# EAGLE schematic GaN_Fet_ESC_V0.2 (EAGLE 9.6.2)

## Sheet 1 of 2: Power Stage
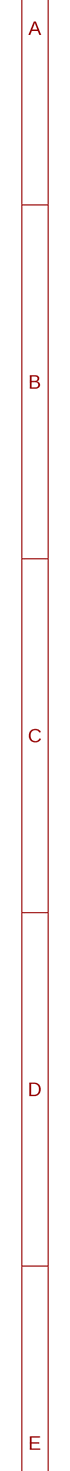
[diagram p0: schematic, sheet 1, part 1 of 2]
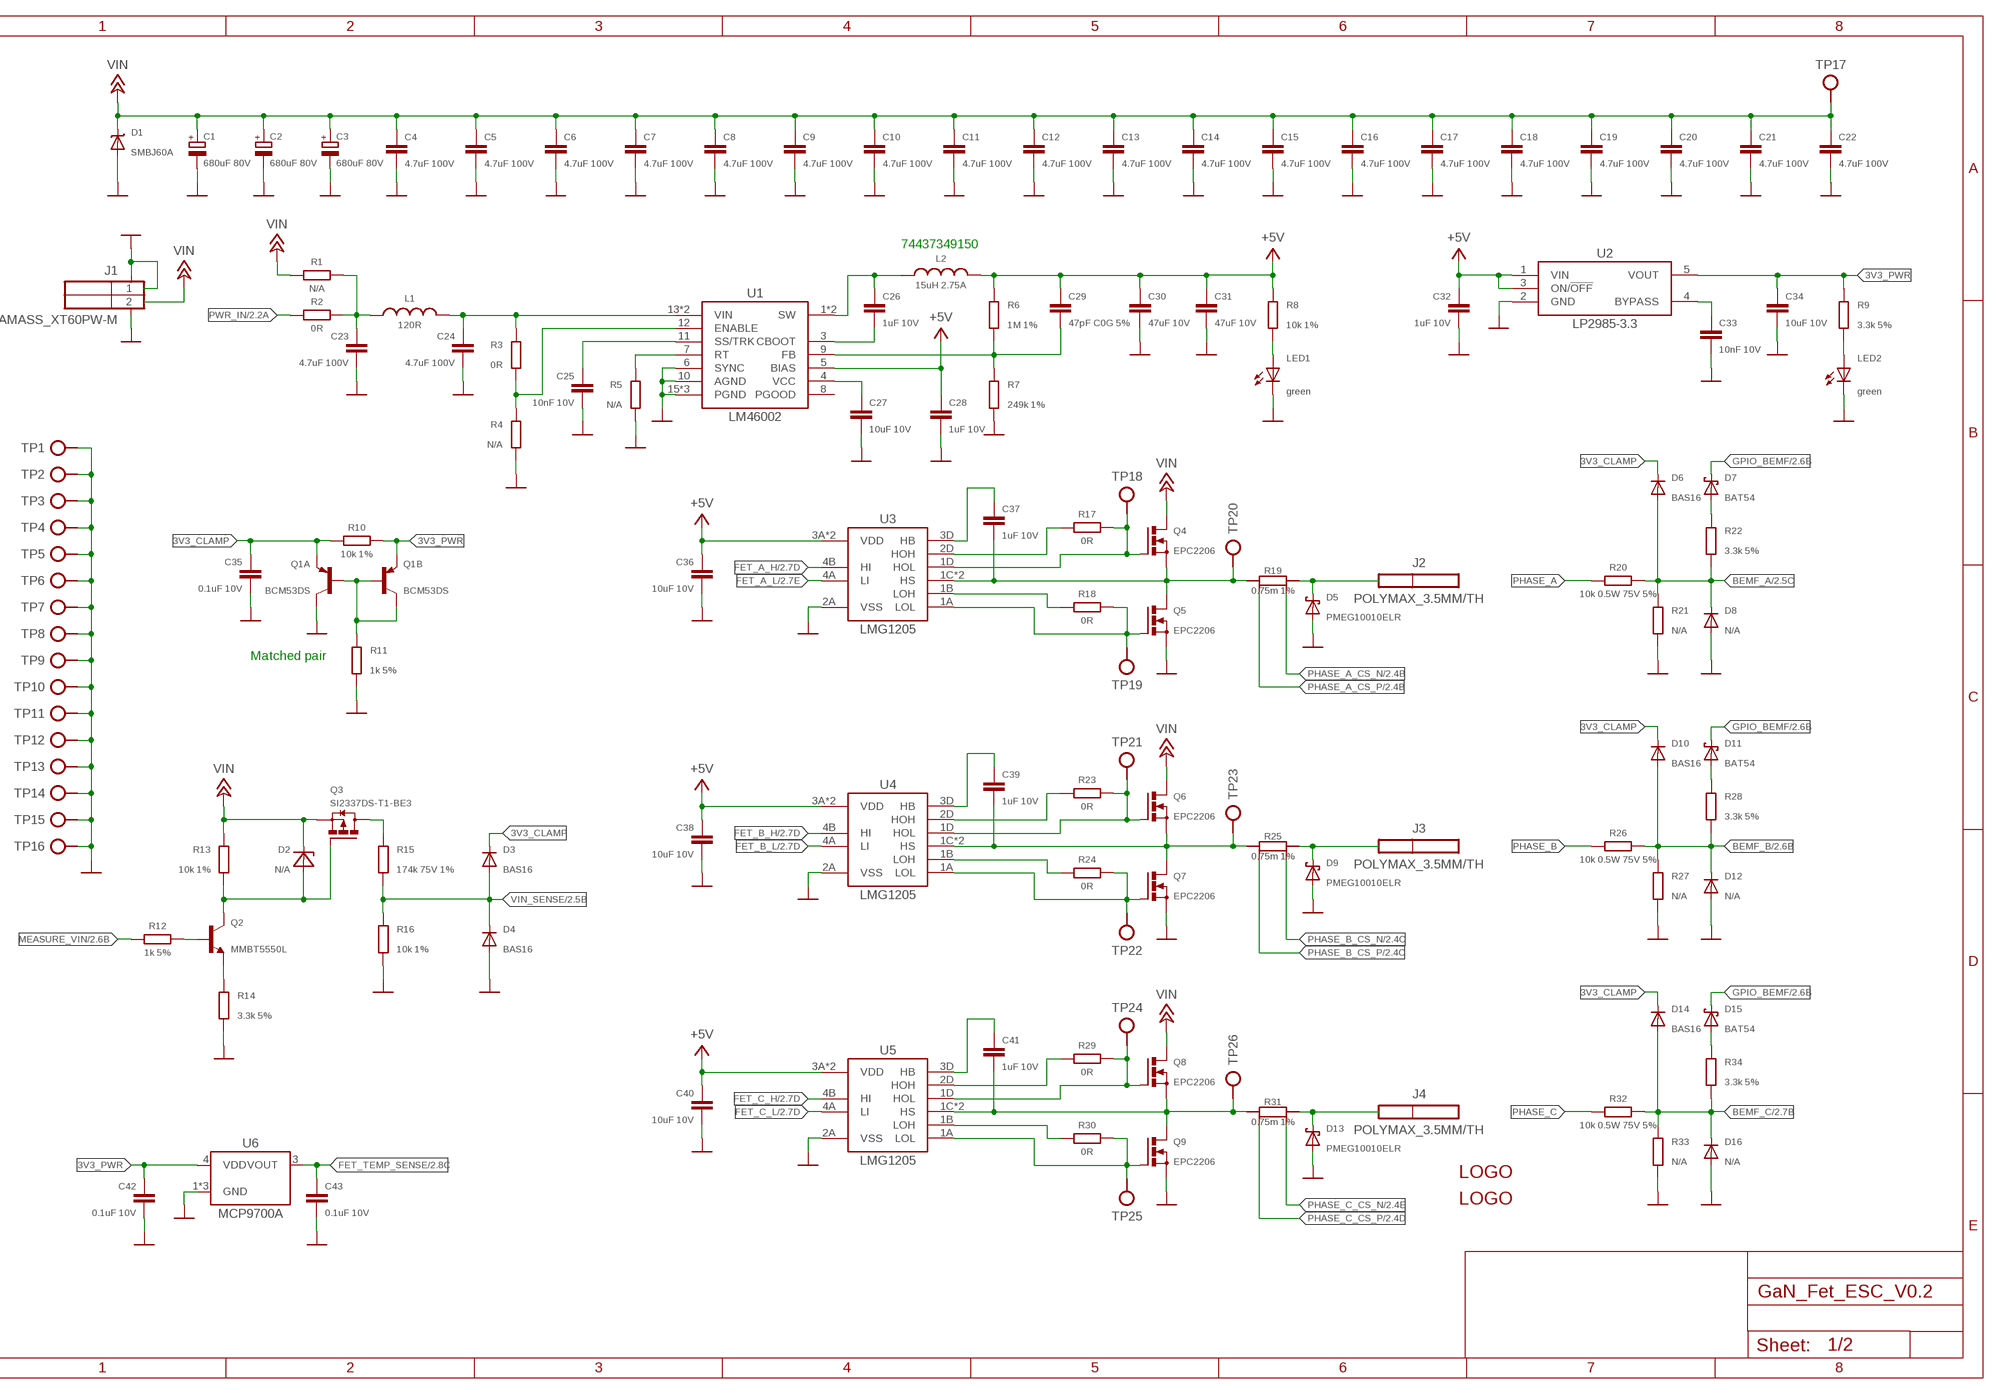
[diagram p1: schematic, sheet 1, part 2 of 2]

### Parts
C1  680uF 80V  CAPACITOR_ELECTROLYTIC4  [C_7.50_16_26.5_4]
C2  680uF 80V  CAPACITOR_ELECTROLYTIC6  [C_7.50_16_26.5_6]
C3  680uF 80V  CAPACITOR_ELECTROLYTIC5  [C_7.50_16_26.5_5]
C4  4.7uF 100V  CAPACITOR_CERAMIC/1210  [C1210]
C5  4.7uF 100V  CAPACITOR_CERAMIC/1210  [C1210]
C6  4.7uF 100V  CAPACITOR_CERAMIC/1210  [C1210]
C7  4.7uF 100V  CAPACITOR_CERAMIC/1210  [C1210]
C8  4.7uF 100V  CAPACITOR_CERAMIC/1210  [C1210]
C9  4.7uF 100V  CAPACITOR_CERAMIC/1210  [C1210]
C10  4.7uF 100V  CAPACITOR_CERAMIC/1210  [C1210]
C11  4.7uF 100V  CAPACITOR_CERAMIC/1210  [C1210]
C12  4.7uF 100V  CAPACITOR_CERAMIC/1210  [C1210]
C13  4.7uF 100V  CAPACITOR_CERAMIC/1210  [C1210]
C14  4.7uF 100V  CAPACITOR_CERAMIC/1210  [C1210]
C15  4.7uF 100V  CAPACITOR_CERAMIC/1210  [C1210]
C16  4.7uF 100V  CAPACITOR_CERAMIC/1210  [C1210]
C17  4.7uF 100V  CAPACITOR_CERAMIC/1210  [C1210]
C18  4.7uF 100V  CAPACITOR_CERAMIC/1210  [C1210]
C19  4.7uF 100V  CAPACITOR_CERAMIC/1210  [C1210]
C20  4.7uF 100V  CAPACITOR_CERAMIC/1210  [C1210]
C21  4.7uF 100V  CAPACITOR_CERAMIC/1210  [C1210]
C22  4.7uF 100V  CAPACITOR_CERAMIC/1210  [C1210]
C23  4.7uF 100V  CAPACITOR_CERAMIC/1210  [C1210]
C24  4.7uF 100V  CAPACITOR_CERAMIC/1210  [C1210]
C25  10nF 10V  CAPACITOR_CERAMIC/0402  [C0402]
C26  1uF 10V  CAPACITOR_CERAMIC/0402  [C0402]
C27  10uF 10V  CAPACITOR_CERAMIC/0603  [C0603]
C28  1uF 10V  CAPACITOR_CERAMIC/0402  [C0402]
C29  47pF C0G 5%  CAPACITOR_CERAMIC/0402  [C0402]
C30  47uF 10V  CAPACITOR_CERAMIC/1206  [C1206]
C31  47uF 10V  CAPACITOR_CERAMIC/1206  [C1206]
C32  1uF 10V  CAPACITOR_CERAMIC/0402  [C0402]
C33  10nF 10V  CAPACITOR_CERAMIC/0402  [C0402]
C34  10uF 10V  CAPACITOR_CERAMIC/0603  [C0603]
C35  0.1uF 10V  CAPACITOR_CERAMIC/0402  [C0402]
C36  10uF 10V  CAPACITOR_CERAMIC/0603  [C0603]
C37  1uF 10V  CAPACITOR_CERAMIC/0402  [C0402]
C38  10uF 10V  CAPACITOR_CERAMIC/0603  [C0603]
C39  1uF 10V  CAPACITOR_CERAMIC/0402  [C0402]
C40  10uF 10V  CAPACITOR_CERAMIC/0603  [C0603]
C41  1uF 10V  CAPACITOR_CERAMIC/0402  [C0402]
C42  0.1uF 10V  CAPACITOR_CERAMIC/0402  [C0402]
C43  0.1uF 10V  CAPACITOR_CERAMIC/0402  [C0402]
D1  SMBJ60A  DIODE_TVS_UNIDIR/SMB  [DO214AA(SMB)]
D2  N/A  DIODE_ZENER  [SOD323F]
D3  BAS16  DIODE/SOD523  [SOD523]
D4  BAS16  DIODE/SOD523  [SOD523]
D5  PMEG10010ELR  DIODE_SCHOTTKY/SOD123  [SOD123F]
D6  BAS16  DIODE/SOD523  [SOD523]
D7  BAT54  DIODE_SCHOTTKY/SOD523  [SOD523]
D8  N/A  DIODE/SOD523  [SOD523]
D9  PMEG10010ELR  DIODE_SCHOTTKY/SOD123  [SOD123F]
D10  BAS16  DIODE/SOD523  [SOD523]
D11  BAT54  DIODE_SCHOTTKY/SOD523  [SOD523]
D12  N/A  DIODE/SOD523  [SOD523]
D13  PMEG10010ELR  DIODE_SCHOTTKY/SOD123  [SOD123F]
D14  BAS16  DIODE/SOD523  [SOD523]
D15  BAT54  DIODE_SCHOTTKY/SOD523  [SOD523]
D16  N/A  DIODE/SOD523  [SOD523]
J1  AMASS_XT60PW-M  [AMASS_XT60PW-M]
J2  POLYMAX_3.5MM/TH  [POLYMAX_3.5MM_TH]
J3  POLYMAX_3.5MM/TH  [POLYMAX_3.5MM_TH]
J4  POLYMAX_3.5MM/TH  [POLYMAX_3.5MM_TH]
L1  120R  INDUCTOR/1206  [L1206]
L2  15uH 2.75A  INDUCTOR/WE-LHMI  [WURTH_6.6X6.6]
LED1  green  LED/0603  [CHIP-LED0603]
LED2  green  LED/0603  [CHIP-LED0603]
LOGO1  LOGO  [LOGO]
LOGO2  LOGO  [LOGO]
Q1  BCM53DS  BJT_PNP_DUAL/BCM53DS  [SC-74]
Q2  MMBT5550L  BJT_NPN/SOT23  [SOT23]
Q3  SI2337DS-T1-BE3  P-FET/SOT23  [SOT23]
Q4  EPC2206  GAN-N-FET  [EPC2206]
Q5  EPC2206  GAN-N-FET  [EPC2206]
Q6  EPC2206  GAN-N-FET  [EPC2206]
Q7  EPC2206  GAN-N-FET  [EPC2206]
Q8  EPC2206  GAN-N-FET  [EPC2206]
Q9  EPC2206  GAN-N-FET  [EPC2206]
R1  N/A  RESISTOR_SMD/0603  [R0603]
R2  0R  RESISTOR_SMD/0603  [R0603]
R3  0R  RESISTOR_SMD/0603  [R0603]
R4  N/A  RESISTOR_SMD/0402  [R0402]
R5  N/A  RESISTOR_SMD/0402  [R0402]
R6  1M 1%  RESISTOR_SMD/0402  [R0402]
R7  249k 1%  RESISTOR_SMD/0402  [R0402]
R8  10k 1%  RESISTOR_SMD/0402  [R0402]
R9  3.3k 5%  RESISTOR_SMD/0402  [R0402]
R10  10k 1%  RESISTOR_SMD/0402  [R0402]
R11  1k 5%  RESISTOR_SMD/0402  [R0402]
R12  1k 5%  RESISTOR_SMD/0402  [R0402]
R13  10k 1%  RESISTOR_SMD/0402  [R0402]
R14  3.3k 5%  RESISTOR_SMD/0402  [R0402]
R15  174k 75V 1%  RESISTOR_SMD/0603  [R0603]
R16  10k 1%  RESISTOR_SMD/0402  [R0402]
R17  0R  RESISTOR_SMD/0402  [R0402]
R18  0R  RESISTOR_SMD/0402  [R0402]
R19  0.75m 1%  RESISTOR_KELVIN/CRF2512  [CSS2H-2512]
R20  10k 0.5W 75V 5%  RESISTOR_SMD/0805  [R0805]
R21  N/A  RESISTOR_SMD/0402  [R0402]
R22  3.3k 5%  RESISTOR_SMD/0402  [R0402]
R23  0R  RESISTOR_SMD/0402  [R0402]
R24  0R  RESISTOR_SMD/0402  [R0402]
R25  0.75m 1%  RESISTOR_KELVIN/CRF2512  [CSS2H-2512]
R26  10k 0.5W 75V 5%  RESISTOR_SMD/0805  [R0805]
R27  N/A  RESISTOR_SMD/0402  [R0402]
R28  3.3k 5%  RESISTOR_SMD/0402  [R0402]
R29  0R  RESISTOR_SMD/0402  [R0402]
R30  0R  RESISTOR_SMD/0402  [R0402]
R31  0.75m 1%  RESISTOR_KELVIN/CRF2512  [CSS2H-2512]
R32  10k 0.5W 75V 5%  RESISTOR_SMD/0805  [R0805]
R33  N/A  RESISTOR_SMD/0402  [R0402]
R34  3.3k 5%  RESISTOR_SMD/0402  [R0402]
TP1  TESTPOINT0.5MM  [0.5MM]
TP2  TESTPOINT0.5MM  [0.5MM]
TP3  TESTPOINT0.5MM  [0.5MM]
TP4  TESTPOINT0.5MM  [0.5MM]
TP5  TESTPOINT0.5MM  [0.5MM]
TP6  TESTPOINT0.5MM  [0.5MM]
TP7  TESTPOINT0.5MM  [0.5MM]
TP8  TESTPOINT0.5MM  [0.5MM]
TP9  TESTPOINT0.5MM  [0.5MM]
TP10  TESTPOINT0.5MM  [0.5MM]
TP11  TESTPOINT0.5MM  [0.5MM]
TP12  TESTPOINT0.5MM  [0.5MM]
TP13  TESTPOINT0.5MM  [0.5MM]
TP14  TESTPOINT0.5MM  [0.5MM]
TP15  TESTPOINT0.5MM  [0.5MM]
TP16  TESTPOINT0.5MM  [0.5MM]
TP17  TESTPOINT/0.9MM  [0.9MM]
TP18  TESTPOINT/0.9MM  [0.9MM]
TP19  TESTPOINT/0.9MM  [0.9MM]
TP20  TESTPOINT/0.9MM  [0.9MM]
TP21  TESTPOINT/0.9MM  [0.9MM]
TP22  TESTPOINT/0.9MM  [0.9MM]
TP23  TESTPOINT/0.9MM  [0.9MM]
TP24  TESTPOINT/0.9MM  [0.9MM]
TP25  TESTPOINT/0.9MM  [0.9MM]
TP26  TESTPOINT/0.9MM  [0.9MM]
U1  LM46002  [TSS0P16-PAD]
U2  LP2985-3.3  LP2985  [SOT-23-5]
U3  LMG1205  [LMG1205]
U4  LMG1205  [LMG1205]
U5  LMG1205  [LMG1205]
U6  MCP9700A  MCP9700/SC-70-5  [SC-70-5]

### Nets
3V3_CLAMP: C35.1 D3.C D6.C D10.C D14.C Q1.5(A:E) R10.1
3V3_PWR: C34.1 C42.1 Q1.4(B:E) R9.2 R10.2 U2.5(VOUT) U6.4(VDD)
3V3_SINK: Q1.1(A:B) Q1.2(B:B) Q1.3(B:C) R11.2
5V_VCC: C27.1 U1.4(VCC)
5V_VIN: C24.1 L1.2 R3.2 U1.13(VIN) U1.14(VIN)
+5V: C28.1 C29.1 C30.1 C31.1 C32.1 C36.1 C38.1 C40.1 L2.2 R6.2 R8.2 U1.5(BIAS) U2.1(VIN) U2.3(ON/!OFF) U3.3A(VDD) U3.4C(VDD) U4.3A(VDD) U4.4C(VDD) U5.3A(VDD) U5.4C(VDD) ; also sheet 2
BEMF_A: D6.A D8.C R20.2 R21.2 R22.1 ; also sheet 2
BEMF_B: D10.A D12.C R26.2 R27.2 R28.1 ; also sheet 2
BEMF_C: D14.A D16.C R32.2 R33.2 R34.1 ; also sheet 2
CBOOT: C26.2 U1.3(CBOOT)
ENABLE: R3.1 R4.2 U1.12(ENABLE)
FB: C29.2 R6.1 R7.2 U1.9(FB)
FET_A_H: U3.4B(HI) ; also sheet 2
FET_A_L: U3.4A(LI) ; also sheet 2
FET_B_H: U4.4B(HI) ; also sheet 2
FET_B_L: U4.4A(LI) ; also sheet 2
FET_C_H: U5.4B(HI) ; also sheet 2
FET_C_L: U5.4A(LI) ; also sheet 2
FET_TEMP_SENSE: C43.1 U6.3(VOUT) ; also sheet 2
GANFET_A_HB: C37.1 U3.3D(HB)
GANFET_A_HOH: R17.1 U3.2D(HOH)
GANFET_A_HOL: Q4.1(G) R17.2 TP18.P$1 U3.1D(HOL)
GANFET_A_HS: C37.2 Q4.2(S) Q4.5(S) Q4.6(S) Q4.9(S) Q4.10(S) Q4.13(S) Q4.14(S) Q4.17(S) Q4.18(S) Q4.21(S) Q4.22(S) Q4.25(S) Q4.26(S) Q4.29(S) Q4.30(S) Q5.3(D) Q5.4(D) Q5.7(D) Q5.8(D) Q5.11(D) Q5.12(D) Q5.15(D) Q5.16(D) Q5.19(D) Q5.20(D) Q5.23(D) Q5.24(D) Q5.27(D) Q5.28(D) R19.1 R19.3 TP20.P$1 U3.1C(HS) U3.4D(HS)
GANFET_A_LOH: R18.1 U3.1B(LOH)
GANFET_A_LOL: Q5.1(G) R18.2 TP19.P$1 U3.1A(LOL)
GANFET_B_HB: C39.1 U4.3D(HB)
GANFET_B_HOH: R23.1 U4.2D(HOH)
GANFET_B_HOL: Q6.1(G) R23.2 TP21.P$1 U4.1D(HOL)
GANFET_B_HS: C39.2 Q6.2(S) Q6.5(S) Q6.6(S) Q6.9(S) Q6.10(S) Q6.13(S) Q6.14(S) Q6.17(S) Q6.18(S) Q6.21(S) Q6.22(S) Q6.25(S) Q6.26(S) Q6.29(S) Q6.30(S) Q7.3(D) Q7.4(D) Q7.7(D) Q7.8(D) Q7.11(D) Q7.12(D) Q7.15(D) Q7.16(D) Q7.19(D) Q7.20(D) Q7.23(D) Q7.24(D) Q7.27(D) Q7.28(D) R25.1 R25.3 TP23.P$1 U4.1C(HS) U4.4D(HS)
GANFET_B_LOH: R24.1 U4.1B(LOH)
GANFET_B_LOL: Q7.1(G) R24.2 TP22.P$1 U4.1A(LOL)
GANFET_C_HB: C41.1 U5.3D(HB)
GANFET_C_HOH: R29.1 U5.2D(HOH)
GANFET_C_HOL: Q8.1(G) R29.2 TP24.P$1 U5.1D(HOL)
GANFET_C_HS: C41.2 Q8.2(S) Q8.5(S) Q8.6(S) Q8.9(S) Q8.10(S) Q8.13(S) Q8.14(S) Q8.17(S) Q8.18(S) Q8.21(S) Q8.22(S) Q8.25(S) Q8.26(S) Q8.29(S) Q8.30(S) Q9.3(D) Q9.4(D) Q9.7(D) Q9.8(D) Q9.11(D) Q9.12(D) Q9.15(D) Q9.16(D) Q9.19(D) Q9.20(D) Q9.23(D) Q9.24(D) Q9.27(D) Q9.28(D) R31.1 R31.3 TP26.P$1 U5.1C(HS) U5.4D(HS)
GANFET_C_LOH: R30.1 U5.1B(LOH)
GANFET_C_LOL: Q9.1(G) R30.2 TP25.P$1 U5.1A(LOL)
GND: C1.- C2.- C3.- C4.2 C5.2 C6.2 C7.2 C8.2 C9.2 C10.2 C11.2 C12.2 C13.2 C14.2 C15.2 C16.2 C17.2 C18.2 C19.2 C20.2 C21.2 C22.2 C23.2 C24.2 C25.2 C27.2 C28.2 C30.2 C31.2 C32.2 C33.2 C34.2 C35.2 C36.2 C38.2 C40.2 C42.2 C43.2 D1.A D4.A D5.A D8.A D9.A D12.A D13.A D16.A J1.1 J1.3 J1.4 LED1.C LED2.C Q1.6(A:C) Q5.2(S) Q5.5(S) Q5.6(S) Q5.9(S) Q5.10(S) Q5.13(S) Q5.14(S) Q5.17(S) Q5.18(S) Q5.21(S) Q5.22(S) Q5.25(S) Q5.26(S) Q5.29(S) Q5.30(S) Q7.2(S) Q7.5(S) Q7.6(S) Q7.9(S) Q7.10(S) Q7.13(S) Q7.14(S) Q7.17(S) Q7.18(S) Q7.21(S) Q7.22(S) Q7.25(S) Q7.26(S) Q7.29(S) Q7.30(S) Q9.2(S) Q9.5(S) Q9.6(S) Q9.9(S) Q9.10(S) Q9.13(S) Q9.14(S) Q9.17(S) Q9.18(S) Q9.21(S) Q9.22(S) Q9.25(S) Q9.26(S) Q9.29(S) Q9.30(S) R4.1 R5.1 R7.1 R11.1 R14.1 R16.1 R21.1 R27.1 R33.1 TP1.P$1 TP2.P$1 TP3.P$1 TP4.P$1 TP5.P$1 TP6.P$1 TP7.P$1 TP8.P$1 TP9.P$1 TP10.P$1 TP11.P$1 TP12.P$1 TP13.P$1 TP14.P$1 TP15.P$1 TP16.P$1 U1.6(SYNC) U1.10(AGND) U1.15(PGND) U1.16(PGND) U1.PAD(PGND) U2.2(GND) U3.2A(VSS) U4.2A(VSS) U5.2A(VSS) U6.1(GND) U6.2(GND) U6.5(GND) ; also sheet 2
GPIO_BEMF: D7.C D11.C D15.C ; also sheet 2
LDO_BYPASS: C33.1 U2.4(BYPASS)
MEASURE_VIN: R12.1 ; also sheet 2
N$3: Q2.2(E) R14.2
N$5: LED1.A R8.1
N$10: D11.A R28.2
N$13: D7.A R22.2
N$14: D15.A R34.2
N$15: LED2.A R9.1
N$16: Q2.1(B) R12.2
N$28: Q3.3(D) R15.2
N$35: C23.1 L1.1 R1.2 R2.2
N$759: D2.A Q2.3(C) Q3.1(G) R13.1
PHASE_A: D5.C J2.1 R19.2 R19.4 R20.1
PHASE_A_CS_N: R19.2_SENSE(2K) ; also sheet 2
PHASE_A_CS_P: R19.1_SENSE(1K) ; also sheet 2
PHASE_B: D9.C J3.1 R25.2 R25.4 R26.1
PHASE_B_CS_N: R25.2_SENSE(2K) ; also sheet 2
PHASE_B_CS_P: R25.1_SENSE(1K) ; also sheet 2
PHASE_C: D13.C J4.1 R31.2 R31.4 R32.1
PHASE_C_CS_N: R31.2_SENSE(2K) ; also sheet 2
PHASE_C_CS_P: R31.1_SENSE(1K) ; also sheet 2
PWR_IN: R2.1 ; also sheet 2
RT: R5.2 U1.7(RT)
SS: C25.1 U1.11(SS/TRK)
SW: C26.1 L2.1 U1.1(SW) U1.2(SW)
VIN: C1.+ C2.+ C3.+ C4.1 C5.1 C6.1 C7.1 C8.1 C9.1 C10.1 C11.1 C12.1 C13.1 C14.1 C15.1 C16.1 C17.1 C18.1 C19.1 C20.1 C21.1 C22.1 D1.K(C) D2.C J1.2 Q3.2(S) Q4.3(D) Q4.4(D) Q4.7(D) Q4.8(D) Q4.11(D) Q4.12(D) Q4.15(D) Q4.16(D) Q4.19(D) Q4.20(D) Q4.23(D) Q4.24(D) Q4.27(D) Q4.28(D) Q6.3(D) Q6.4(D) Q6.7(D) Q6.8(D) Q6.11(D) Q6.12(D) Q6.15(D) Q6.16(D) Q6.19(D) Q6.20(D) Q6.23(D) Q6.24(D) Q6.27(D) Q6.28(D) Q8.3(D) Q8.4(D) Q8.7(D) Q8.8(D) Q8.11(D) Q8.12(D) Q8.15(D) Q8.16(D) Q8.19(D) Q8.20(D) Q8.23(D) Q8.24(D) Q8.27(D) Q8.28(D) R1.1 R13.2 TP17.P$1
VIN_SENSE: D3.A D4.C R15.1 R16.2 ; also sheet 2
Unconnected: U1.8(PGOOD)

### Notes on the sheet
- 74437349150
- Matched pair

## Sheet 2 of 2: Signal Processing
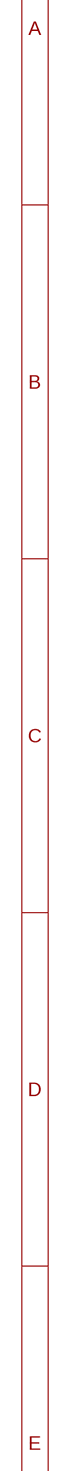
[diagram p2: schematic, sheet 2, part 1 of 2]
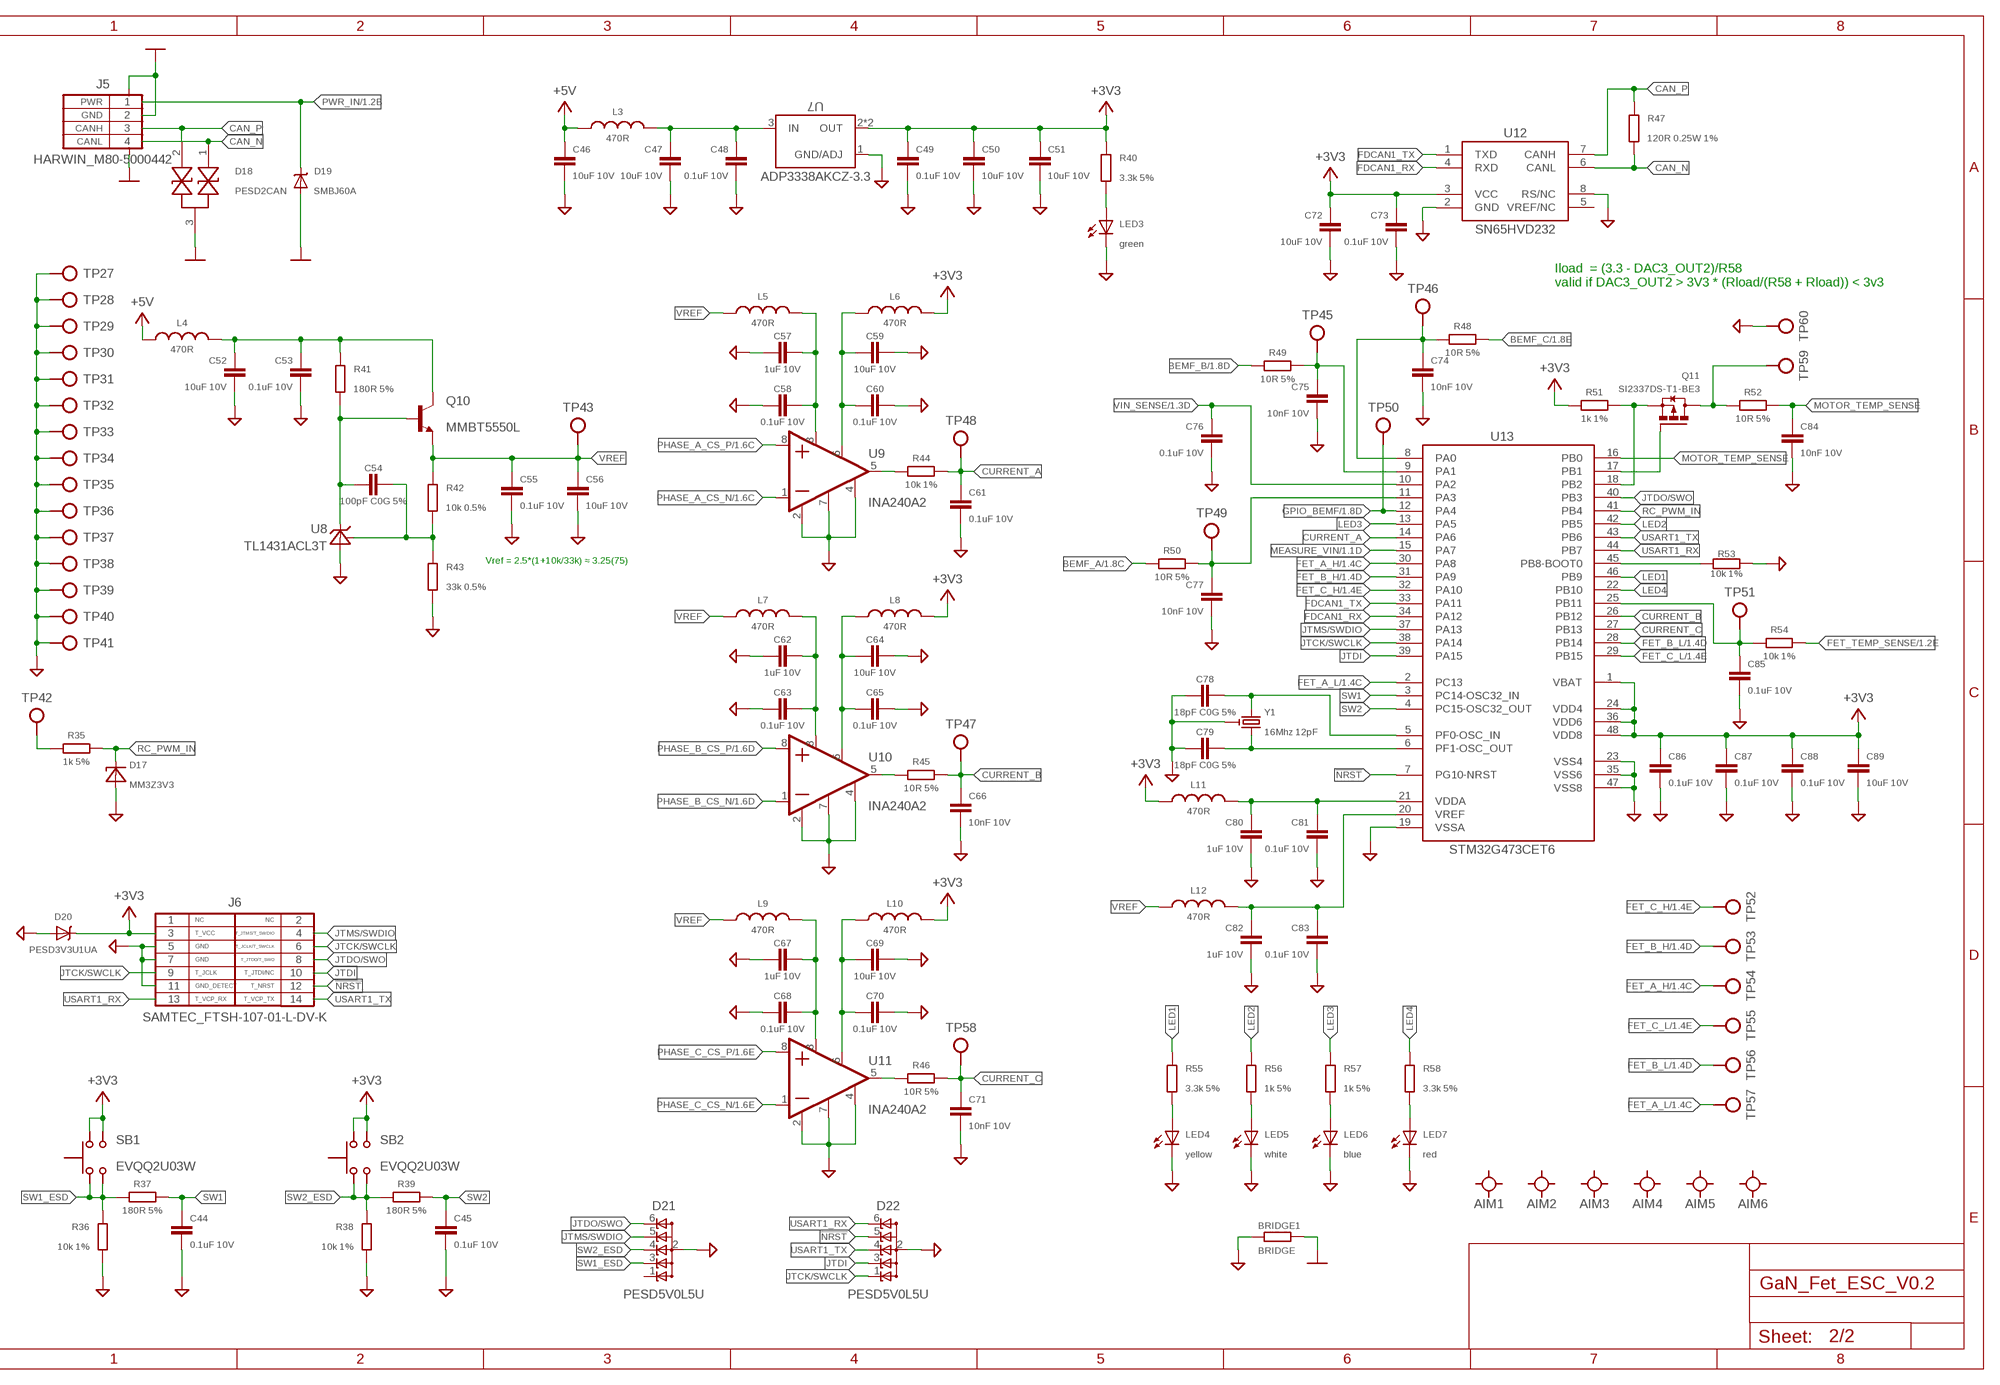
[diagram p3: schematic, sheet 2, part 2 of 2]

### Parts
AIM1  AIM_1_MM  [AIM_1_MM]
AIM2  AIM_1_MM  [AIM_1_MM]
AIM3  AIM_1_MM  [AIM_1_MM]
AIM4  AIM_1_MM  [AIM_1_MM]
AIM5  AIM_1_MM  [AIM_1_MM]
AIM6  AIM_1_MM  [AIM_1_MM]
BRIDGE1  BRIDGE  [BRIDGE]
C44  0.1uF 10V  CAPACITOR_CERAMIC/0402  [C0402]
C45  0.1uF 10V  CAPACITOR_CERAMIC/0402  [C0402]
C46  10uF 10V  CAPACITOR_CERAMIC/0603  [C0603]
C47  10uF 10V  CAPACITOR_CERAMIC/0603  [C0603]
C48  0.1uF 10V  CAPACITOR_CERAMIC/0402  [C0402]
C49  0.1uF 10V  CAPACITOR_CERAMIC/0402  [C0402]
C50  10uF 10V  CAPACITOR_CERAMIC/0603  [C0603]
C51  10uF 10V  CAPACITOR_CERAMIC/0603  [C0603]
C52  10uF 10V  CAPACITOR_CERAMIC/0603  [C0603]
C53  0.1uF 10V  CAPACITOR_CERAMIC/0402  [C0402]
C54  100pF C0G 5%  CAPACITOR_CERAMIC/0402  [C0402]
C55  0.1uF 10V  CAPACITOR_CERAMIC/0402  [C0402]
C56  10uF 10V  CAPACITOR_CERAMIC/0603  [C0603]
C57  1uF 10V  CAPACITOR_CERAMIC/0402  [C0402]
C58  0.1uF 10V  CAPACITOR_CERAMIC/0402  [C0402]
C59  10uF 10V  CAPACITOR_CERAMIC/0603  [C0603]
C60  0.1uF 10V  CAPACITOR_CERAMIC/0402  [C0402]
C61  0.1uF 10V  CAPACITOR_CERAMIC/0402  [C0402]
C62  1uF 10V  CAPACITOR_CERAMIC/0402  [C0402]
C63  0.1uF 10V  CAPACITOR_CERAMIC/0402  [C0402]
C64  10uF 10V  CAPACITOR_CERAMIC/0603  [C0603]
C65  0.1uF 10V  CAPACITOR_CERAMIC/0402  [C0402]
C66  10nF 10V  CAPACITOR_CERAMIC/0402  [C0402]
C67  1uF 10V  CAPACITOR_CERAMIC/0402  [C0402]
C68  0.1uF 10V  CAPACITOR_CERAMIC/0402  [C0402]
C69  10uF 10V  CAPACITOR_CERAMIC/0603  [C0603]
C70  0.1uF 10V  CAPACITOR_CERAMIC/0402  [C0402]
C71  10nF 10V  CAPACITOR_CERAMIC/0402  [C0402]
C72  10uF 10V  CAPACITOR_CERAMIC/0603  [C0603]
C73  0.1uF 10V  CAPACITOR_CERAMIC/0402  [C0402]
C74  10nF 10V  CAPACITOR_CERAMIC/0402  [C0402]
C75  10nF 10V  CAPACITOR_CERAMIC/0402  [C0402]
C76  0.1uF 10V  CAPACITOR_CERAMIC/0402  [C0402]
C77  10nF 10V  CAPACITOR_CERAMIC/0402  [C0402]
C78  18pF C0G 5%  CAPACITOR_CERAMIC/0402  [C0402]
C79  18pF C0G 5%  CAPACITOR_CERAMIC/0402  [C0402]
C80  1uF 10V  CAPACITOR_CERAMIC/0402  [C0402]
C81  0.1uF 10V  CAPACITOR_CERAMIC/0402  [C0402]
C82  1uF 10V  CAPACITOR_CERAMIC/0402  [C0402]
C83  0.1uF 10V  CAPACITOR_CERAMIC/0402  [C0402]
C84  10nF 10V  CAPACITOR_CERAMIC/0402  [C0402]
C85  0.1uF 10V  CAPACITOR_CERAMIC/0402  [C0402]
C86  0.1uF 10V  CAPACITOR_CERAMIC/0402  [C0402]
C87  0.1uF 10V  CAPACITOR_CERAMIC/0402  [C0402]
C88  0.1uF 10V  CAPACITOR_CERAMIC/0402  [C0402]
C89  10uF 10V  CAPACITOR_CERAMIC/0603  [C0603]
D17  MM3Z3V3  DIODE_ZENER  [SOD323F]
D18  PESD2CAN  DIODE_TVS_DUAL  [SOT23]
D19  SMBJ60A  DIODE_TVS_UNIDIR/SMB  [DO214AA(SMB)]
D20  PESD3V3U1UA  DIODE_TVS_UNIDIR/SOD323  [SOD323F]
D21  PESD5V0L5U  ESD_5  [SC-70-6]
D22  PESD5V0L5U  ESD_5  [SC-70-6]
J5  HARWIN_M80-5000442  [HARWIN_M80-5000442]
J6  SAMTEC_FTSH-107-01-L-DV-K  [SAMTEC_FTSH-107-01-L-DV-K]
L3  470R  INDUCTOR/0603  [L0603]
L4  470R  INDUCTOR/0603  [L0603]
L5  470R  INDUCTOR/0603  [L0603]
L6  470R  INDUCTOR/0603  [L0603]
L7  470R  INDUCTOR/0603  [L0603]
L8  470R  INDUCTOR/0603  [L0603]
L9  470R  INDUCTOR/0603  [L0603]
L10  470R  INDUCTOR/0603  [L0603]
L11  470R  INDUCTOR/0603  [L0603]
L12  470R  INDUCTOR/0603  [L0603]
LED3  green  LED/0603  [CHIP-LED0603]
LED4  yellow  LED/0603  [CHIP-LED0603]
LED5  white  LED/0603  [CHIP-LED0603]
LED6  blue  LED/0603  [CHIP-LED0603]
LED7  red  LED/0603  [CHIP-LED0603]
Q10  MMBT5550L  BJT_NPN/SOT23  [SOT23]
Q11  SI2337DS-T1-BE3  P-FET/SOT23  [SOT23]
R35  1k 5%  RESISTOR_SMD/0402  [R0402]
R36  10k 1%  RESISTOR_SMD/0402  [R0402]
R37  180R 5%  RESISTOR_SMD/0402  [R0402]
R38  10k 1%  RESISTOR_SMD/0402  [R0402]
R39  180R 5%  RESISTOR_SMD/0402  [R0402]
R40  3.3k 5%  RESISTOR_SMD/0402  [R0402]
R41  180R 5%  RESISTOR_SMD/0402  [R0402]
R42  10k 0.5%  RESISTOR_SMD/0603  [R0603]
R43  33k 0.5%  RESISTOR_SMD/0603  [R0603]
R44  10k 1%  RESISTOR_SMD/0402  [R0402]
R45  10R 5%  RESISTOR_SMD/0402  [R0402]
R46  10R 5%  RESISTOR_SMD/0402  [R0402]
R47  120R 0.25W 1%  RESISTOR_SMD/0805  [R0805]
R48  10R 5%  RESISTOR_SMD/0402  [R0402]
R49  10R 5%  RESISTOR_SMD/0402  [R0402]
R50  10R 5%  RESISTOR_SMD/0402  [R0402]
R51  1k 1%  RESISTOR_SMD/0402  [R0402]
R52  10R 5%  RESISTOR_SMD/0402  [R0402]
R53  10k 1%  RESISTOR_SMD/0402  [R0402]
R54  10k 1%  RESISTOR_SMD/0402  [R0402]
R55  3.3k 5%  RESISTOR_SMD/0402  [R0402]
R56  1k 5%  RESISTOR_SMD/0402  [R0402]
R57  1k 5%  RESISTOR_SMD/0402  [R0402]
R58  3.3k 5%  RESISTOR_SMD/0402  [R0402]
SB1  EVQQ2U03W  PUSH_BUTTONSMD5.2X5.2  [EVQQ2U03W]
SB2  EVQQ2U03W  PUSH_BUTTONSMD5.2X5.2  [EVQQ2U03W]
TP27  TESTPOINT0.5MM  [0.5MM]
TP28  TESTPOINT0.5MM  [0.5MM]
TP29  TESTPOINT0.5MM  [0.5MM]
TP30  TESTPOINT0.5MM  [0.5MM]
TP31  TESTPOINT0.5MM  [0.5MM]
TP32  TESTPOINT0.5MM  [0.5MM]
TP33  TESTPOINT0.5MM  [0.5MM]
TP34  TESTPOINT0.5MM  [0.5MM]
TP35  TESTPOINT0.5MM  [0.5MM]
TP36  TESTPOINT0.5MM  [0.5MM]
TP37  TESTPOINT0.5MM  [0.5MM]
TP38  TESTPOINT0.5MM  [0.5MM]
TP39  TESTPOINT0.5MM  [0.5MM]
TP40  TESTPOINT0.5MM  [0.5MM]
TP41  TESTPOINT/0.9MM  [0.9MM]
TP42  TESTPOINT/0.9MM  [0.9MM]
TP43  TESTPOINT/0.9MM  [0.9MM]
TP45  TESTPOINT/0.9MM  [0.9MM]
TP46  TESTPOINT/0.9MM  [0.9MM]
TP47  TESTPOINT/0.9MM  [0.9MM]
TP48  TESTPOINT/0.9MM  [0.9MM]
TP49  TESTPOINT/0.9MM  [0.9MM]
TP50  TESTPOINT/0.9MM  [0.9MM]
TP51  TESTPOINT/0.9MM  [0.9MM]
TP52  TESTPOINT/0.9MM  [0.9MM]
TP53  TESTPOINT/0.9MM  [0.9MM]
TP54  TESTPOINT/0.9MM  [0.9MM]
TP55  TESTPOINT/0.9MM  [0.9MM]
TP56  TESTPOINT/0.9MM  [0.9MM]
TP57  TESTPOINT/0.9MM  [0.9MM]
TP58  TESTPOINT/0.9MM  [0.9MM]
TP59  TESTPOINT/0.9MM  [0.9MM]
TP60  TESTPOINT/0.9MM  [0.9MM]
U7  ADP3338AKCZ-3.3  LM317  [SOT223]
U8  TL1431ACL3T  TL431  [SOT23]
U9  INA240A2  INA240/SOIC-8  [SOIC-8]
U10  INA240A2  INA240/SOIC-8  [SOIC-8]
U11  INA240A2  INA240/SOIC-8  [SOIC-8]
U12  SN65HVD232  SN65HVD23X  [SOIC-8]
U13  STM32G473CET6  STM32G4_48  [LQFP-48]
Y1  16Mhz 12pF  CRYSTAL_GROUNDED/SMD_3.2X2.5MM  [CRYSTAL_SMD_3.2X2.5MM]

### Nets
!NRST: D22.5 J6.12 U13.7(PG10-NRST)
+3V3: C49.1 C50.1 C51.1 C72.1 C73.1 C86.1 C87.1 C88.1 C89.1 D20.C J6.3 L6.1 L8.1 L10.1 L11.1 R40.2 R51.2 SB1.2'(B2) SB1.2(B1) SB2.2'(B2) SB2.2(B1) U7.2(OUT) U7.4(OUT) U12.3(VCC) U13.1(VBAT) U13.24(VDD4) U13.36(VDD6) U13.48(VDD8)
+5V: C46.1 L3.2 L4.2 ; also sheet 1
BEMF_A: R50.1 ; also sheet 1
BEMF_A_FILT: C77.1 R50.2 TP49.P$1 U13.11(PA3)
BEMF_B: R49.1 ; also sheet 1
BEMF_B_FILT: C75.1 R49.2 TP45.P$1 U13.9(PA1)
BEMF_C: R48.1 ; also sheet 1
BEMF_C_FILT: C74.1 R48.2 TP46.P$1 U13.8(PA0)
BOOT0: R53.2 U13.45(PB8-BOOT0)
CAN_N: D18.1 J5.4 R47.1 U12.6(CANL)
CAN_P: D18.2 J5.3 R47.2 U12.7(CANH)
CS_A: R44.1 U9.5(OUT)
CS_A_VCC: C59.1 C60.1 L6.2 U9.6(VS)
CS_B: R45.1 U10.5(OUT)
CS_B_VCC: C64.1 C65.1 L8.2 U10.6(VS)
CS_C: R46.2 U11.5(OUT)
CS_C_VCC: C69.1 C70.1 L10.2 U11.6(VS)
CURRENT_A: C61.1 R44.2 TP48.P$1 U13.14(PA6)
CURRENT_B: C66.1 R45.2 TP47.P$1 U13.26(PB12)
CURRENT_C: C71.1 R46.1 TP58.P$1 U13.27(PB13)
CURRENT_SOURCE: Q11.3(D) R52.1 TP59.P$1
FDCAN1_RX: U12.4(RXD) U13.34(PA12)
FDCAN1_TX: U12.1(TXD) U13.33(PA11)
FET_A_H: TP54.P$1 U13.30(PA8) ; also sheet 1
FET_A_L: TP57.P$1 U13.2(PC13) ; also sheet 1
FET_B_H: TP53.P$1 U13.31(PA9) ; also sheet 1
FET_B_L: TP56.P$1 U13.28(PB14) ; also sheet 1
FET_C_H: TP52.P$1 U13.32(PA10) ; also sheet 1
FET_C_L: TP55.P$1 U13.29(PB15) ; also sheet 1
FET_TEMP_SENSE: R54.1 ; also sheet 1
FET_TEMP_SENSE_FILT: C85.1 R54.2 TP51.P$1 U13.25(PB11)
GND: BRIDGE1.2 D18.3 D19.A J5.2 J5.5 J5.6 J5.7 J5.8 ; also sheet 1
GND1: BRIDGE1.1 C44.2 C45.2 C46.2 C47.2 C48.2 C49.2 C50.2 C51.2 C52.2 C53.2 C55.2 C56.2 C57.2 C58.2 C59.2 C60.2 C61.2 C62.2 C63.2 C64.2 C65.2 C66.2 C67.2 C68.2 C69.2 C70.2 C71.2 C72.2 C73.2 C74.2 C75.2 C76.2 C77.2 C78.1 C79.1 C80.2 C81.2 C82.2 C83.2 C84.2 C85.2 C86.2 C87.2 C88.2 C89.2 D17.A D20.A D21.2 D22.2 J6.5 J6.7 J6.11 LED3.C LED4.C LED5.C LED6.C LED7.C R36.1 R38.1 R43.1 R53.1 TP27.P$1 TP28.P$1 TP29.P$1 TP30.P$1 TP31.P$1 TP32.P$1 TP33.P$1 TP34.P$1 TP35.P$1 TP36.P$1 TP37.P$1 TP38.P$1 TP39.P$1 TP40.P$1 TP41.P$1 TP60.P$1 U7.1(GND/ADJ) U8.3(A) U9.2(GND) U9.4(NC) U9.7(REF1) U10.2(GND) U10.4(NC) U10.7(REF1) U11.2(GND) U11.4(NC) U11.7(REF1) U12.2(GND) U12.8(RS/NC) U13.19(VSSA) U13.23(VSS4) U13.35(VSS6) U13.47(VSS8) Y1.2 Y1.4
GPIO_BEMF: TP50.P$1 U13.12(PA4) ; also sheet 1
JTCK/SWCLK: D22.1 J6.6 J6.9 U13.38(PA14)
JTDI: D22.3 J6.10 U13.39(PA15)
JTDO/SWO: D21.6 J6.8 U13.40(PB3)
JTMS/SWDIO: D21.5 J6.4 U13.37(PA13)
LED1: R55.2 U13.46(PB9)
LED2: R56.2 U13.42(PB5)
LED3: R57.2 U13.13(PA5)
LED4: R58.2 U13.22(PB10)
MCU_VDDA: C80.1 C81.1 L11.2 U13.21(VDDA)
MCU_VEF: C82.1 C83.1 L12.2 U13.20(VREF)
MEASURE_VIN: U13.15(PA7) ; also sheet 1
MOTOR_TEMP_SENSE: C84.1 R52.2 U13.16(PB0)
N$1: LED4.A R55.1
N$2: R35.2 TP42.P$1
N$4: LED3.A R40.1
N$7: LED6.A R57.1
N$8: LED7.A R58.1
N$9: C54.1 Q10.1(B) R41.1 U8.1(C)
N$11: C78.2 U13.5(PF0-OSC_IN) Y1.1
N$12: C79.2 U13.6(PF1-OSC_OUT) Y1.3
N$17: C52.1 C53.1 L4.1 Q10.3(C) R41.2
N$19: C47.1 C48.1 L3.1 U7.3(IN)
N$137: LED5.A R56.1
OPAMP3_VINM: Q11.2(S) R51.1 U13.18(PB2)
OPAMP3_VOUT: Q11.1(G) U13.17(PB1)
PHASE_A_CS_N: U9.1(IN-) ; also sheet 1
PHASE_A_CS_P: U9.8(IN+) ; also sheet 1
PHASE_B_CS_N: U10.1(IN-) ; also sheet 1
PHASE_B_CS_P: U10.8(IN+) ; also sheet 1
PHASE_C_CS_N: U11.1(IN-) ; also sheet 1
PHASE_C_CS_P: U11.8(IN+) ; also sheet 1
PWR_IN: D19.K(C) J5.1 ; also sheet 1
RC_PWM_IN: D17.C R35.1 U13.41(PB4)
SW1: C44.1 R37.1 U13.3(PC14-OSC32_IN)
SW1_ESD: D21.3 R36.2 R37.2 SB1.1'(A2) SB1.1(A1)
SW2: C45.1 R39.1 U13.4(PC15-OSC32_OUT)
SW2_ESD: D21.4 R38.2 R39.2 SB2.1'(A2) SB2.1(A1)
TL431_REF: C54.2 R42.1 R43.2 U8.2(REF)
USART1_RX: D22.6 J6.13 U13.44(PB7)
USART1_TX: D22.4 J6.14 U13.43(PB6)
VIN_SENSE: C76.1 U13.10(PA2) ; also sheet 1
VREF: C55.1 C56.1 L5.2 L7.2 L9.2 L12.1 Q10.2(E) R42.2 TP43.P$1
VREF_A: C57.1 C58.1 L5.1 U9.3(REF2)
VREF_B: C62.1 C63.1 L7.1 U10.3(REF2)
VREF_C: C67.1 C68.1 L9.1 U11.3(REF2)
Unconnected: AIM1.AIM AIM2.AIM AIM3.AIM AIM4.AIM AIM5.AIM AIM6.AIM D21.1 J6.1 J6.2 U12.5(VREF/NC)

### Notes on the sheet
- PWR
- GND
- CANH
- CANL
- Iload  = (3.3 - DAC3_OUT2)/R58
  valid if DAC3_OUT2 > 3V3 * (Rload/(R58 + Rload)) < 3v3
- Vref = 2.5*(1+10k/33k) ≈ 3.25(75)
- NC | NC
- T_VCC | T_JTMS/T_SWDIO
- GND | T_JCLK/T_SWCLK
- GND | T_JTDO/T_SWO
- T_JCLK | T_JTDI/NC
- GND_DETECT | T_NRST
- T_VCP_RX | T_VCP_TX

## Library data of the parts
AIM1-AIM6 = ESC:AIM_1_MM
BRIDGE1 = ESC:BRIDGE
C1-C3 = ESC:CAPACITOR_ELECTROLYTIC
C4-C89 = ESC:CAPACITOR_CERAMIC
D1 D19 D20 = ESC:DIODE_TVS_UNIDIR
D2 D17 = ESC:DIODE_ZENER
D3 D4 D6 D8 D10 D12 D14 D16 = ESC:DIODE
D5 D7 D9 D11 D13 D15 = ESC:DIODE_SCHOTTKY
D18 = ESC:DIODE_TVS_DUAL
D21 D22 = ESC:ESD_5
J1 = ESC:AMASS_XT60PW-M
J2-J4 = ESC:POLYMAX_3.5MM
J5 = ESC:HARWIN_M80-5000442
J6 = ESC:SAMTEC_FTSH-107-01-L-DV-K
L1-L12 = ESC:INDUCTOR
LED1-LED7 = ESC:LED
LOGO1 LOGO2 = ESC:LOGO
Q1 = ESC:BJT_PNP_DUAL
Q2 Q10 = ESC:BJT_NPN
Q3 Q11 = ESC:P-FET
Q4-Q9 = ESC:GAN-N-FET
R1-R18 R20-R24 R26-R30 R32-R58 = ESC:RESISTOR_SMD
R19 R25 R31 = ESC:RESISTOR_KELVIN
SB1 SB2 = ESC:PUSH_BUTTON
TP1-TP43 TP45-TP60 = ESC:TESTPOINT
U1 = ESC:LM46002
U2 = ESC:LP2985
U3-U5 = ESC:LMG1205
U6 = ESC:MCP9700
U7 = ESC:LM317
U8 = ESC:TL431
U9-U11 = ESC:INA240
U12 = ESC:SN65HVD23X
U13 = ESC:STM32G4_48
Y1 = ESC:CRYSTAL_GROUNDED

## Net classes
1 HV: clearance 0.61 mm